# Altium schematic sheet DB10005_USBSerial.SchDoc: USB Serial interface
size A4; SheetNumber: 7; SheetTotal: 7
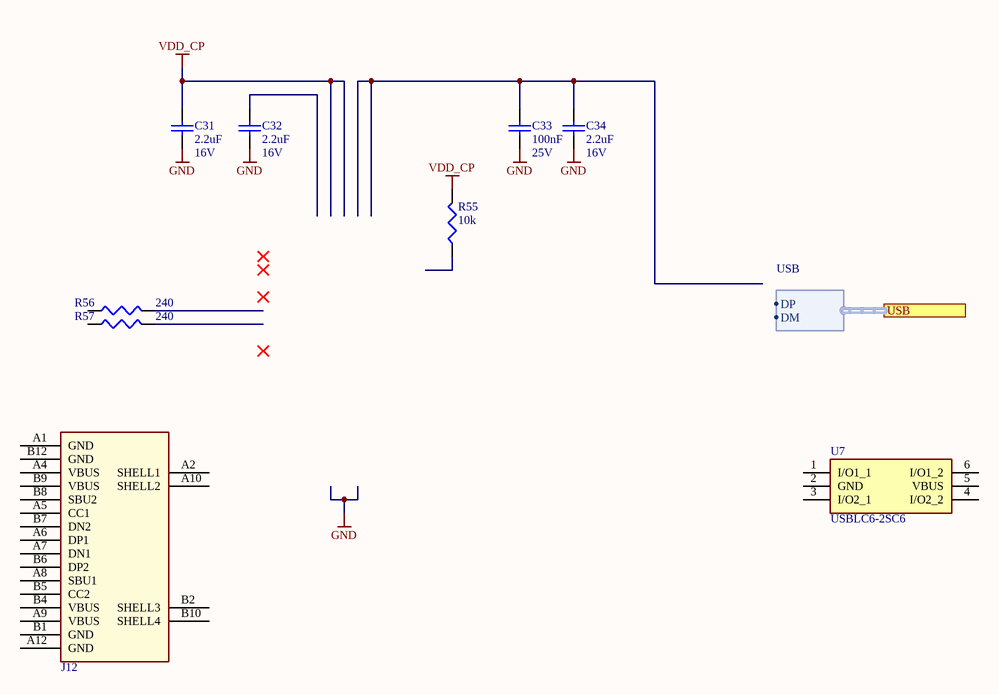
[diagram p0: DB10005_USBSerial.SchDoc]

## Parts
C31  2.2uF  Voltage Rating: 16V  [C0603]
C32  2.2uF  Voltage Rating: 16V  [C0603]
C33  100nF  Voltage Rating: 25V  [C0402]
C34  2.2uF  Voltage Rating: 16V  [C0603]
J12  TYPE-C 16PLC-H10.0  [TYPE-C-TH_16PLC-H10.0]  (value not drawn)
R55  10k  [0402]
R56  240  [0402]
R57  240  [0402]
U7  USBLC6-2SC6  [SOT95P280X145-6N]

## Ports
USB (harness USB)

## Harnesses
USB: DM, DP

## Nets
GND: C31.1 C32.1 C33.1 C34.1
VDD_CP: C31.2 R55.2
NetC33_2: C33.2 C34.2

Not connected (* = marked no-connect by the designer): C32 2; J12 A1(GND) A2(SHELL1) A4(VBUS) A5(CC1) A6(DP1) A7(DN1) A8(SBU1) A9(VBUS) A10(SHELL2) A12(GND) B1(GND) B2(SHELL3) B4(VBUS) B5(CC2) B6(DP2) B7(DN2) B8(SBU2) B9(VBUS) B10(SHELL4) B12(GND); R55 1; R56 1 2; R57 1 2; U7 1(I/O1_1) 2(GND) 3(I/O2_1) 4(I/O2_2) 5(VBUS) 6(I/O1_2)

## Notes on the sheet
- Title
- Size:
- Date:
- A4
- Number:
- Time:
- Revision:
- Sheet
- of
- File:

## Library data of the parts
C31 C32 C34 = 2.2uF/0603/CER/16V: Capacitor, 2.2uF, 16V, X5R; Capacitance Tolerance: +/- 10%; Capacitor Case Style: 0603; Brand Number: GRM188R61C225KE15D; Brand: MURATA; Dielectric Characteristic: X5R; Capacitance: 2.2uF; Temperature Range: -55°C to 85°C; Price: 0,077; Order Code Supplier: 1735526; Supplier: Farnell
C33 = 100nF/0402/CER/25V: Capacitor, 100nF, 25V, X7R; Capacitance Tolerance: 10nF; Capacitor Case Style: 0402; Brand Number: GRM155R71E104KE14D; Brand: MULTICOMP; Dielectric Characteristic: X7R; Capacitance: 100nF; Temperature Range: -55 to +125 C; Price: 0,0225; Order Code Supplier: 2456106; Supplier: Farnell
J12 = TYPE-C 16PLC-H10.0: 连接器类型:Type-C;标准:USB 3.1;公母:母;安装方式:直插;触点数量:16P;端口数量:1;额定电流 - 电源:5A;触头材质:-;触头镀层:-;工作温度范围:-40℃~+85℃;; Manufacturer: SHOU HAN(首韩); Add into BOM: yes; Gender: 母; Number of Contacts: 16P; Number of Ports: 1; Current Rating - Power (Max): 5A; Rated Voltage (Max): 20V; Connect-Disconnect Life: 1万次; Core Colour: 黑色; Symbol: TYPE-C 16PLC-H10.0; Device: TYPE-C 16PLC-H10.0; LCSC Part Name: Type-C 母 直插; Supplier Part: C3151747; Manufacturer Part: TYPE-C 16PLC-H10.0; Supplier Footprint: 插件; Datasheet: https://atta.szlcsc.com/upload/public/pdf/source/20240529/CC9428849977884A813B584EA396EFE9.pdf; Supplier: LCSC; Convert to PCB: yes; Connector Type: Type-C; Standard: USB 3.1; Mounting Style: 直插; Contact Material: -; Contact Plating: -; Operating Temperature Range: -40℃~+85℃
R55 = 10k/0402/0063W/50V: Resistor, 10k, 0.1%, 0.0625W, 50V, 100PPM, 0402; Brand: VISHAY DRALORIC; Brand Number: CRCW040210K0FKED; Power Rating: 0.063W; Case Style: 0402; Order Code Supplier: 2121730; Price: 0,0005; Resistance: 10k; Supplier: Farnell; Temperature Coefficient: ± 100PPM; Temperature Range: -55°C to +125°C; Voltage Rating: 50V
R56 R57 = 240/0402/0063W/50V: Resistor, 240, 0.1%, 0.0625W, 50V, 100PPM, 0402; Brand: VISHAY DRALORIC; Brand Number: CRCW0402240RFKED; Power Rating: 0.063W; Case Style: 0402; Order Code Supplier: 2121522; Price: 0,0006; Resistance: 240; Supplier: Farnell; Temperature Coefficient: ± 100PPM; Temperature Range: -55°C to +125°C; Voltage Rating: 50V
U7 = USBLC6-2SC6: Integrated Circuit; Manufacturer_Name: STMicroelectronics; Datasheet Link: http://www.st.com/st-web-ui/static/active/en/resource/technical/document/datasheet/CD00050750.pdf; Height: 1.45mm; Manufacturer_Part_Number: USBLC6-2SC6; Mouser Part Number: 511-USBLC6-2SC6; Mouser Price/Stock: https://www.mouser.co.uk/ProductDetail/STMicroelectronics/USBLC6-2SC6?qs=po45yt2pPpu%2FhNIlwQdTlg%3D%3D; Arrow Part Number: USBLC6-2SC6; Arrow Price/Stock: https://www.arrow.com/en/products/usblc6-2sc6/stmicroelectronics?utm_currency=USD&region=europe